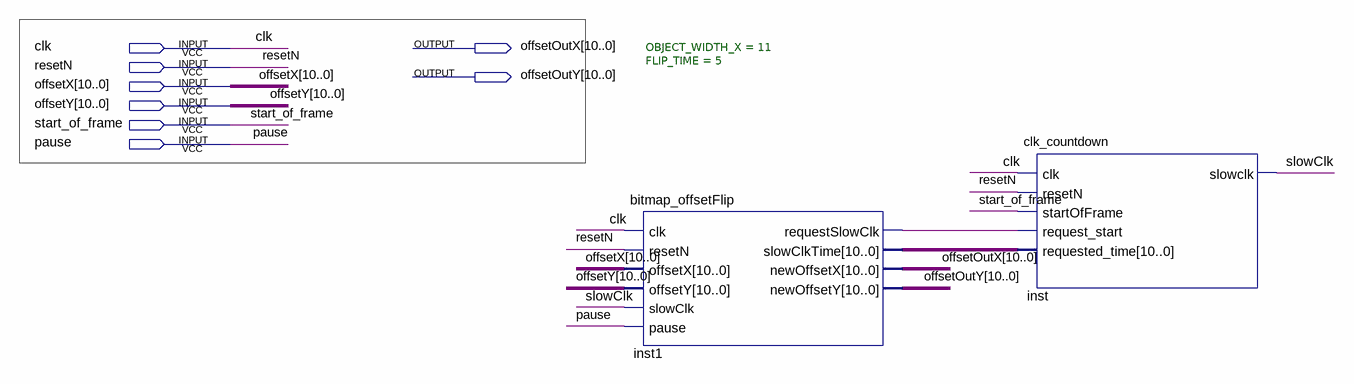
[diagram p0: schematic sheet]
// Quartus schematic bitmap_flip.bdf as structural Verilog: 2 symbols, 8 pins
module bitmap_flip (
  input  clk,
  input  resetN,
  input  [10:0] offsetX,
  input  [10:0] offsetY,
  input  start_of_frame,
  input  pause,
  output [10:0] offsetOutX,
  output [10:0] offsetOutY
);

  wire inst1_requestslowclk, slowClk;
  wire [10:0] inst1_slowclktime;

  bitmap_offsetFlip #(.OBJECT_WIDTH_X(11), .FLIP_TIME(5)) inst1 (
    .clk(clk), .resetN(resetN), .offsetX(offsetX), .offsetY(offsetY), .slowClk(slowClk), .pause(pause),
    .requestSlowClk(inst1_requestslowclk), .slowClkTime(inst1_slowclktime), .newOffsetX(offsetOutX),
    .newOffsetY(offsetOutY));
  clk_countdown inst (
    .clk(clk), .resetN(resetN), .startOfFrame(start_of_frame), .request_start(inst1_requestslowclk),
    .requested_time(inst1_slowclktime), .slowclk(slowClk));
endmodule
